# Altium project TIDA-010056.PrjPcb
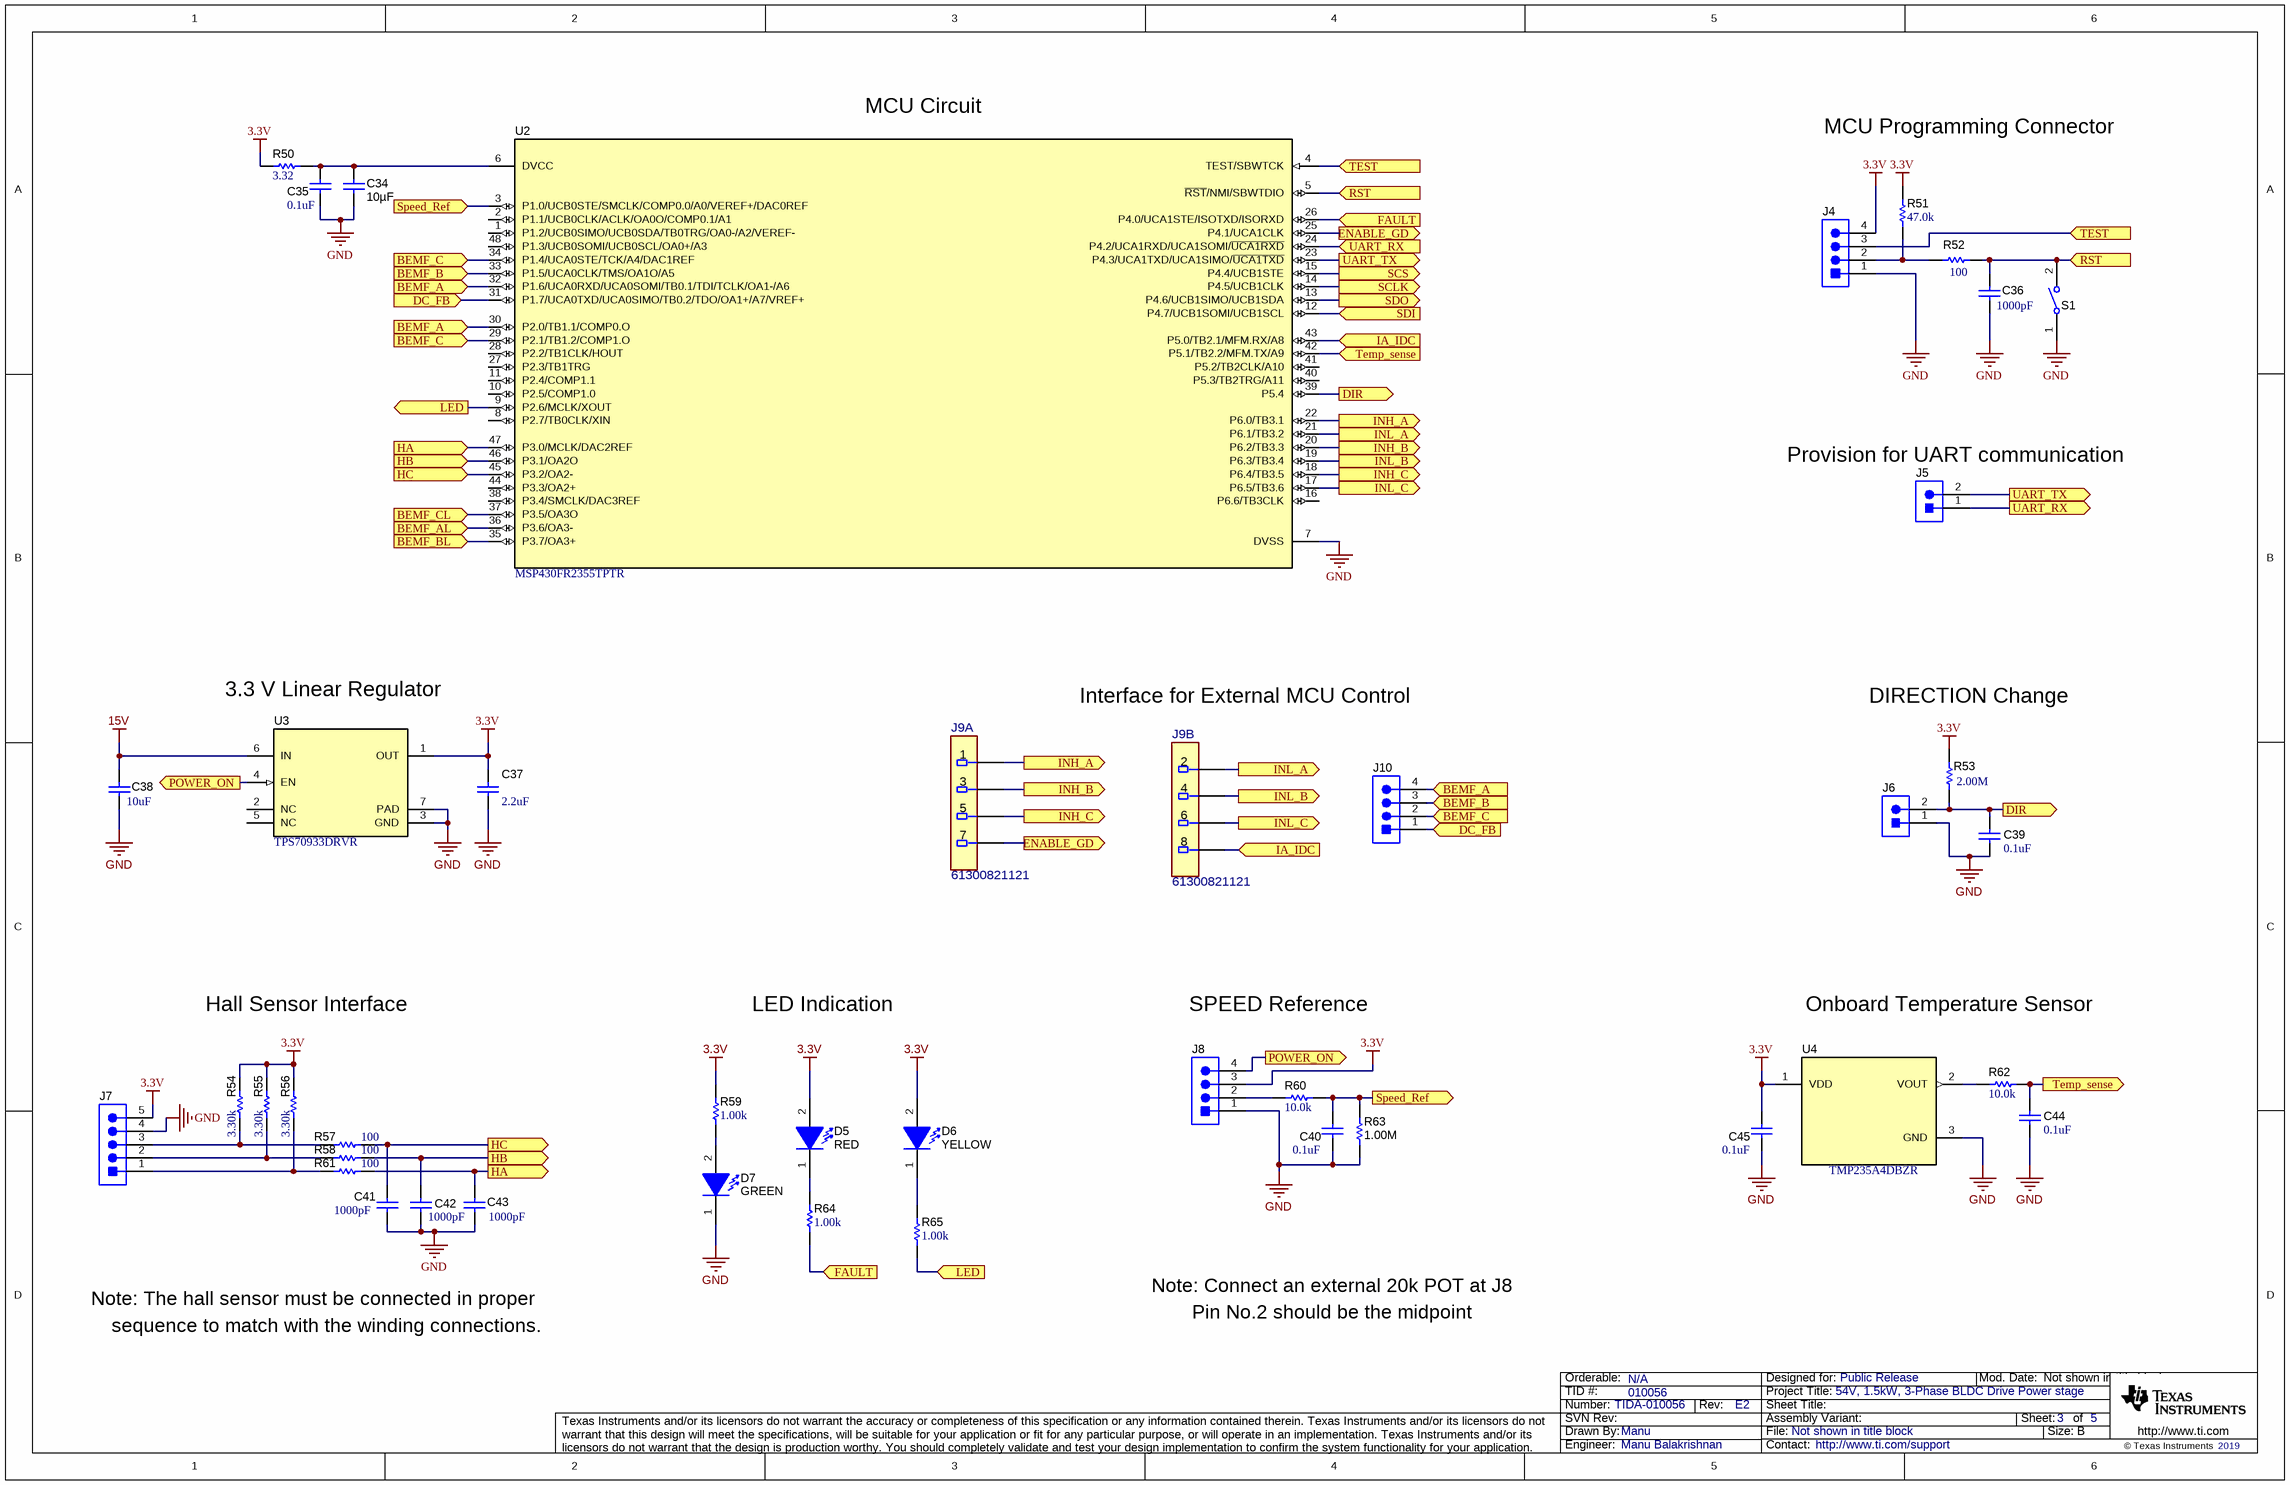
[diagram p0: TIDA-010056_Page2.SchDoc]
CopyrightYear: 2019; EVM_orderable: N/A; PCB_Layout: Manu Balakrishnan; PCB_Rev: E2; PRJ_Customer: Public Release; PRJ_Engineer: Manu Balakrishnan; PRJ_Number: TIDA-010056; PRJ_Title: 54V, 1.5kW, 3-Phase BLDC Drive Power stage; SCH_Rev: E2; TechSupport: http://www.ti.com/support; TID: 010056
3 sheets, 54 parts. Net scope: flat (ports and power ports of the same name join across sheets).
Board file: TIDA-010056.PcbDoc
Sheets:
  TIDA-010056_coversheet.SchDoc
  TIDA-010056_Page2.SchDoc
  TIDA-010056_Hardware.SchDoc

## Sheet TIDA-010056_coversheet.SchDoc
size 431 x 279 mm; Date: Not shown in title block; ApprovedBy: Not shown in title block; CheckedBy: Not shown in title block; Author: Not shown in title block; CompanyName: Not shown in title block; DrawnBy: Manu; Engineer: Not shown in title block; Organization: Not shown in title block; Address1: Not shown in title block; Address2: Not shown in title block; Address3: Not shown in title block; Address4: Not shown in title block; DocumentNumber: 1; Revision: Use project parameter SCH_Rev; SheetNumber: 1; SheetTotal: 5; PageSetup: Record=PageOptions|CenterHorizontal=True|CenterVertical=True|PrintScale=1.00|XCorrection=1.00|YCorrection=1.00|PrintKind=0|BorderSize=5000000|LeftOffset=0|BottomOffset=0|Orientation=2|PaperLength=1000|PaperWidth=1000|Scale=100|PaperSource=15|PrintQuality=600|MediaType=1|DitherType=10|PaperKind=Letter|PrintScaleMode=1; CurrentTime: Not shown in title block; CurrentDate: Not shown in title block; Time: Not shown in title block; DocumentFullPathAndName: Not shown in title block; DocumentName: Not shown in title block; ModifiedDate: Not shown in title block; ImagePath: Not shown in title block

### Notes on the sheet
- Drawn By:
- SVN Rev:
- Number:
- TID #:
- Orderable:
- Rev:
- Sheet Title:
- File:
- Project Title:
- Designed for:
- Assembly Variant:
- Mod. Date:
- Sheet:
- Size:
- of
- B
- http://www.ti.com
- Texas Instruments and/or its licensors do not warrant the accuracy or completeness of this specification or any information contained therein. Texas Instruments and/or its licensors do not warrant that this design will meet the specifications, will be suitable for your application or fit for any particular purpose, or will operate in an implementation. Texas Instruments and/or its licensors do not warrant that the design is production worthy. You should completely validate and test your design implementation to confirm the system functionality for your application.
- Engineer:
- Contact:
- © Texas Instruments

## Sheet TIDA-010056_Page2.SchDoc
size 431 x 279 mm; Date: Not shown in title block; ApprovedBy: Not shown in title block; CheckedBy: Not shown in title block; Author: Not shown in title block; CompanyName: Not shown in title block; DrawnBy: Manu; Engineer: Not shown in title block; Organization: Not shown in title block; Address1: Not shown in title block; Address2: Not shown in title block; Address3: Not shown in title block; Address4: Not shown in title block; DocumentNumber: 1; Revision: Use project parameter SCH_Rev; SheetNumber: 3; SheetTotal: 5; PageSetup: Record=PageOptions|CenterHorizontal=True|CenterVertical=True|PrintScale=1.00|XCorrection=1.00|YCorrection=1.00|PrintKind=0|BorderSize=5000000|LeftOffset=0|BottomOffset=0|Orientation=2|PaperLength=1000|PaperWidth=1000|Scale=100|PaperSource=15|PrintQuality=600|MediaType=1|DitherType=10|PaperKind=Letter|PrintScaleMode=1; CurrentTime: Not shown in title block; CurrentDate: Not shown in title block; Time: Not shown in title block; DocumentFullPathAndName: Not shown in title block; DocumentName: Not shown in title block; ModifiedDate: Not shown in title block; ImagePath: Not shown in title block

### Parts
C34  ValueDisplayed: 10µF  [0603]  (hidden comment: GRM188R61A106KE69D)
C35  ValueDisplayed: 0.1uF  [0402]  (hidden comment: GCM155R71A104KA55D)
C36  ValueDisplayed: 1000pF  [0402]  (hidden comment: GRM155R71C102KA01D)
C37  ValueDisplayed: 2.2uF  [0402]  (hidden comment: 885012105013)
C38  ValueDisplayed: 10uF  [1206_190]  (hidden comment: C3216X7R1V106M160AC)
C39  ValueDisplayed: 0.1uF  [0402]  (hidden comment: GCM155R71A104KA55D)
C40  ValueDisplayed: 0.1uF  [0402]  (hidden comment: GCM155R71A104KA55D)
C41  ValueDisplayed: 1000pF  [0402]  (hidden comment: GRM155R71C102KA01D)
C42  ValueDisplayed: 1000pF  [0402]  (hidden comment: GRM155R71C102KA01D)
C43  ValueDisplayed: 1000pF  [0402]  (hidden comment: GRM155R71C102KA01D)
C44  ValueDisplayed: 0.1uF  [0402]  (hidden comment: GCM155R71A104KA55D)
C45  ValueDisplayed: 0.1uF  [0402]  (hidden comment: GCM155R71A104KA55D)
D5  value RED  [WL-SMCW_GREEN]  (hidden comment: 150060GS75000)
D6  value YELLOW  [WL-SMCW_GREEN]  (hidden comment: 150060GS75000)
D7  value GREEN  [WL-SMCW_GREEN]  (hidden comment: 150060GS75000)
J4  61300411121  [WURTH_61300411121]  (value not drawn)
J5  61300211121  [WURTH_61300211121]  (value not drawn)
J6  61300211121  [WURTH_61300211121]  (value not drawn)
J7  61300511121  [Wurth_61300511121]  (value not drawn)
J8  61300411121  [WURTH_61300411121]  (value not drawn)
J9  61300821121  [FP-61300821121_HDR8-MFG]  (parts A,B of 2)
J10  61300411121  [WURTH_61300411121]  (value not drawn)
R50  ValueDisplayed: 3.32  [0402]  (hidden comment: CRCW04023R32FKED)
R51  ValueDisplayed: 47.0k  [0402]  (hidden comment: RC0402FR-0747KL)
R52  ValueDisplayed: 100  [0402]  (hidden comment: ERJ-2GEJ101X)
R53  ValueDisplayed: 2.00M  [0402]  (hidden comment: CRCW04022M00FKED)
R54  ValueDisplayed: 3.30k  [0402]  (hidden comment: ERJ-2RKF3301X)
R55  ValueDisplayed: 3.30k  [0402]  (hidden comment: ERJ-2RKF3301X)
R56  ValueDisplayed: 3.30k  [0402]  (hidden comment: ERJ-2RKF3301X)
R57  ValueDisplayed: 100  [0402]  (hidden comment: ERJ-2GEJ101X)
R58  ValueDisplayed: 100  [0402]  (hidden comment: ERJ-2GEJ101X)
R59  ValueDisplayed: 1.00k  [0402]  (hidden comment: ERJ-2RKF1001X)
R60  ValueDisplayed: 10.0k  [0402]  (hidden comment: ERJ-2RKF1002X)
R61  ValueDisplayed: 100  [0402]  (hidden comment: ERJ-2GEJ101X)
R62  ValueDisplayed: 10.0k  [0402]  (hidden comment: ERJ-2RKF1002X)
R63  ValueDisplayed: 1.00M  [0402]  (hidden comment: ERJ-2RKF1004X)
R64  ValueDisplayed: 1.00k  [0402]  (hidden comment: ERJ-2RKF1001X)
R65  ValueDisplayed: 1.00k  [0402]  (hidden comment: ERJ-2RKF1001X)
S1  434121025816  [SW_434121025816]  (value not drawn)
U2  MSP430FR2355TPTR  [PT0048A_N]
U3  TPS70933DRVR  [DRV0006A]
U4  TMP235A4DBZR  [DBZ0003A_N]

### Ports
BEMF_A (in), BEMF_AL (in), BEMF_B (in), BEMF_BL (in), BEMF_C (in), BEMF_CL (in), DC_FB (in), DIR (out), ENABLE_GD (out), FAULT (in), HA (in), HA (out), HB (in), HB (out), HC (in), HC (out), IA_IDC (in), INH_A (out), INH_B (out), INH_C (out), INL_A (out), INL_B (out), INL_C (out), LED (in), LED (out), POWER_ON (out), RST (in), SCLK (out), SCS (out), SDI (in), SDO (out), Speed_Ref (in), Speed_Ref (out), Temp_sense (in), Temp_sense (out), TEST (in), UART_RX (in), UART_RX (out), UART_TX (out)

### Nets
3.3V: C37.1 C45.1 D5.2(A) D6.2(A) J4.4 J7.5 J8.3 R50.1 R51.2 R53.2 R54.2 R55.2 R56.2 R59.2 U3.1(OUT) U4.1(VDD)
15V: C38.1 U3.6(IN)
GND: C34.2 C35.2 C36.2 C37.2 C38.2 C39.2 C40.2 C41.2 C42.2 C43.2 C44.2 C45.2 D7.1(K) J4.1 J6.1 J7.4 J8.1 R63.1 S1.1 U2.7(DVSS) U3.3(GND) U3.7(PAD) U4.3(GND)
BEMF_A: J10.4 U2.30(P2.0/TB1.1/COMP0.O) U2.32(P1.6/UCA0RXD/UCA0SOMI/TB0.1/TDI/TCLK/OA1-/A6) ; port BEMF_A
BEMF_AL: U2.36(P3.6/OA3-) ; port BEMF_AL
BEMF_B: J10.3 U2.33(P1.5/UCA0CLK/TMS/OA1O/A5) ; port BEMF_B
BEMF_BL: U2.35(P3.7/OA3+) ; port BEMF_BL
BEMF_C: J10.2 U2.29(P2.1/TB1.2/COMP1.O) U2.34(P1.4/UCA0STE/TCK/A4/DAC1REF) ; port BEMF_C
BEMF_CL: U2.37(P3.5/OA3O) ; port BEMF_CL
DC_FB: J10.1 U2.31(P1.7/UCA0TXD/UCA0SIMO/TB0.2/TDO/OA1+/A7/VREF+) ; port DC_FB
DIR: C39.1 J6.2 R53.1 U2.39(P5.4) ; port DIR
ENABLE_GD: J9.7 U2.25(P4.1/UCA1CLK) ; port ENABLE_GD
FAULT: R64.1 U2.26(P4.0/UCA1STE/ISOTXD/ISORXD) ; port FAULT
HA: C43.1 R61.2 U2.47(P3.0/MCLK/DAC2REF) ; port HA
HB: C42.1 R58.2 U2.46(P3.1/OA2O) ; port HB
HC: C41.1 R57.2 U2.45(P3.2/OA2-) ; port HC
IA_IDC: J9.8 U2.43(P5.0/TB2.1/MFM.RX/A8) ; port IA_IDC
INH_A: J9.1 U2.22(P6.0/TB3.1) ; port INH_A
INH_B: J9.3 U2.20(P6.2/TB3.3) ; port INH_B
INH_C: J9.5 U2.18(P6.4/TB3.5) ; port INH_C
INL_A: J9.2 U2.21(P6.1/TB3.2) ; port INL_A
INL_B: J9.4 U2.19(P6.3/TB3.4) ; port INL_B
INL_C: J9.6 U2.17(P6.5/TB3.6) ; port INL_C
LED: R65.1 U2.9(P2.6/MCLK/XOUT) ; port LED
POWER_ON: J8.4 U3.4(EN) ; port POWER_ON
RST: C36.1 R52.2 S1.2 U2.5(~{RST}/NMI/SBWTDIO) ; port RST
SCLK: U2.14(P4.5/UCB1CLK) ; port SCLK
SCS: U2.15(P4.4/UCB1STE) ; port SCS
SDI: U2.12(P4.7/UCB1SOMI/UCB1SCL) ; port SDI
SDO: U2.13(P4.6/UCB1SIMO/UCB1SDA) ; port SDO
Speed_Ref: C40.1 R60.1 R63.2 U2.3(P1.0/UCB0STE/SMCLK/COMP0.0/A0/VEREF+/DAC0REF) ; port Speed_Ref
Temp_sense: C44.1 R62.1 U2.42(P5.1/TB2.2/MFM.TX/A9) ; port Temp_sense
TEST: J4.3 U2.4(TEST/SBWTCK) ; port TEST
UART_RX: J5.1 U2.24(P4.2/UCA1RXD/UCA1SOMI/~{UCA1RXD}) ; port UART_RX
UART_TX: J5.2 U2.23(P4.3/UCA1TXD/UCA1SIMO/~{UCA1TXD}) ; port UART_TX
NetC34_1: C34.1 C35.1 R50.2 U2.6(DVCC)
NetD5_1: D5.1(K) R64.2
NetD6_1: D6.1(K) R65.2
NetD7_2: D7.2(A) R59.1
NetJ4_2: J4.2 R51.1 R52.1
NetJ7_1: J7.1 R56.1 R61.1
NetJ7_2: J7.2 R55.1 R58.1
NetJ7_3: J7.3 R54.1 R57.1
NetJ8_2: J8.2 R60.2
NetR62_2: R62.2 U4.2(VOUT)

Not connected (* = marked no-connect by the designer): U2 1(P1.2/UCB0SIMO/UCB0SDA/TB0TRG/OA0-/A2/VEREF-) 2(P1.1/UCB0CLK/ACLK/OA0O/COMP0.1/A1) 8(P2.7/TB0CLK/XIN) 10(P2.5/COMP1.0) 11(P2.4/COMP1.1) 16(P6.6/TB3CLK) 27(P2.3/TB1TRG) 28(P2.2/TB1CLK/HOUT) 38(P3.4/SMCLK/DAC3REF) 40(P5.3/TB2TRG/A11) 41(P5.2/TB2CLK/A10) 44(P3.3/OA2+) 48(P1.3/UCB0SOMI/UCB0SCL/OA0+/A3); U3 2(NC) 5(NC)

### Notes on the sheet
- (near U2) MCU Circuit
- MCU Programming Connector
- (near J5) Provision for UART communication
- 3.3 V Linear Regulator
- Interface for External MCU Control
- DIRECTION Change
- Hall Sensor Interface
- LED Indication
- SPEED Reference
- Onboard Temperature Sensor
- Note: The hall sensor must be connected in proper
- Note: Connect an external 20k POT at J8
- sequence to match with the winding connections.
- Pin No.2 should be the midpoint
- Drawn By:
- SVN Rev:
- Number:
- TID #:
- Orderable:
- Rev:
- Sheet Title:
- File:
- Project Title:
- Designed for:
- Assembly Variant:
- Mod. Date:
- Sheet:
- Size:
- of
- B
- http://www.ti.com
- Texas Instruments and/or its licensors do not warrant the accuracy or completeness of this specification or any information contained therein. Texas Instruments and/or its licensors do not warrant that this design will meet the specifications, will be suitable for your application or fit for any particular purpose, or will operate in an implementation. Texas Instruments and/or its licensors do not warrant that the design is production worthy. You should completely validate and test your design implementation to confirm the system functionality for your application.
- Engineer:
- Contact:
- © Texas Instruments

### Library data of the parts
C34 = CMP-0085855-1: CAP, CERM, 10 µF, 10 V,+/- 10%, X5R, 0603; Manufacturer: MuRata; SizeX_mm: 1.6; Value2: 10V; SizeAreaWB_mm2: 4.68; Green_REACh: Incomplete; AEC Category: Q200; SizeArea_mm2: 1.28; SizeY_mm: 0.8; Green_Lifecycle: Active; TaMax_C: 85°C; Value: 10uF; U/M: EA; Polarized: N; TaMin_C: -55°C; SizeZ_mm: 1; CompType: Capacitor; ComponentLink1URL: https://search.murata.co.jp/Ceramy/image/img/A01X/G101/ENG/GRM188R61A106KE69-01.pdf; RoHS: Y; AEC Grade: N/A; PackageReference: 0603; Cap_F: 10µF; ComponentLink1Description: Datasheet link; PartNumber: GRM188R61A106KE69D; Green_EU RoHS: Passed; Green_EU RoHS-2: Incomplete; Cap_Case: 0603; Tolerance_%: 10%; MountType: SMT; Technology: Ceramic; AEC Qualified: N; TempCo: X5R; VDC_V: 10V
C35 C39 C40 C44 C45 = CMP-0006350-2: CAP, CERM, 0.1 uF, 10 V, +/- 10%, X7R, AEC-Q200 Grade 1, 0402; Manufacturer: MuRata; TaMin_C: -55°C; Polarized: N; SizeAreaWB_mm2: 3; Value1: Unknown; U/M: EA; Value: 0.1uF; TaMax_C: 125°C; SizeZ_mm: 0.6; SizeX_mm: 1; SizeY_mm: 0.5; Value2: 10V; AEC Qualified: Y; Cap_F: 100nF; AEC Category: Q200; Publisher: Texas Instruments; TempCo: X7R; Published: 2008-06-19; RoHS: Y; MountType: SMT; Supplier 1: Mouser; PackageReference: 0402; Tolerance_%: 10%; Cap_Case: 0402; SizeArea_mm2: 0.5; CompType: Capacitor; LatestRevisionDate: 2017-03-09; PartNumber: GCM155R71A104KA55D; VDC_V: 10V; ComponentLink1Description: Datasheet link; AEC Grade: 1; Supplier Part Number 1: 81-GCM155R71A104K5D; Technology: Ceramic; ComponentLink1URL: http://search.murata.co.jp/Ceramy/image/img/A01X/G101/ENG/GCM155R71A104KA55-01.pdf
C36 C41-C43 = CMP-0006638-2: CAP, CERM, 1000 pF, 16 V, +/- 10%, X7R, 0402; Manufacturer: MuRata; TaMin_C: -55°C; Polarized: N; SizeAreaWB_mm2: 3; Value1: Unknown; U/M: EA; Value: 1000pF; TaMax_C: 125°C; SizeZ_mm: 0.6; SizeX_mm: 1; SizeY_mm: 0.5; Value2: 16V; Cap_F: 1nF; AEC Category: Q200; Supplier Part Number 2: 81-GRM155R71C102KA1D; Publisher: Texas Instruments; Supplier 2: Mouser; TempCo: X7R; Published: 2008-06-19; RoHS: Y; MountType: SMT; Supplier 1: Digi-Key; PackageReference: 0402; Tolerance_%: 10%; Cap_Case: 0402; SizeArea_mm2: 0.5; CompType: Capacitor; LatestRevisionDate: 2017-03-09; PartNumber: GRM155R71C102KA01D; AEC Qualified: ?; VDC_V: 16V; ComponentLink1Description: Datasheet link; Supplier Part Number 1: GRM155R71C102KA01D-ND; Technology: Ceramic; ComponentLink1URL: http://search.murata.co.jp/Ceramy/PnsearchViewAction.do?HnOFG=ON&HnNFG=ON&SEL_CNT=50&sLang=en&sKey=GRM155R71C102KA01D&x=9&y=9&search=startwith
C37 = CMP-0006222-2: CAP, CERM, 2.2 uF, 10 V, +/- 20%, X5R, 0402; Manufacturer: Wurth Elektronik; TaMin_C: -55°C; Polarized: N; SizeAreaWB_mm2: 3; Value1: Unknown; U/M: EA; Value: 2.2uF; TaMax_C: 85°C; SizeZ_mm: 0.6; SizeX_mm: 1; SizeY_mm: 0.5; Value2: 10V; Cap_F: 2.2µF; AEC Category: Q200; Publisher: Texas Instruments; TempCo: X5R; Published: 2008-06-19; RoHS: Y; MountType: SMT; Supplier 1: Mouser; PackageReference: 0402; Tolerance_%: 20%; Cap_Case: 0402; SizeArea_mm2: 0.5; CompType: Capacitor; LatestRevisionDate: 2017-03-09; PartNumber: 885012105013; AEC Qualified: N; VDC_V: 10V; ComponentLink1Description: Datasheet link; AEC Grade: N/A; Supplier Part Number 1: 710-885012105013; Technology: Ceramic; ComponentLink1URL: http://katalog.we-online.de/pbs/datasheet/885012105013.pdf
C38 = CMP-0008706-2: CAP, CERM, 10 uF, 35 V, +/- 20%, X7R, 1206_190; Manufacturer: TDK; TaMin_C: -55°C; Polarized: N; SizeAreaWB_mm2: 10.92; Value1: Unknown; U/M: EA; Value: 10uF; TaMax_C: 125°C; SizeZ_mm: 1.9; SizeX_mm: 3.2; SizeY_mm: 1.6; Cap_Case: 1206; Value2: 35V; SizeArea_mm2: 5.12; Cap_F: 10µF; AEC Category: Q200; Supplier Part Number 2: 04X3300; Publisher: Texas Instruments; Supplier 2: Newark; Supplier Part Number 3: 810-C3216X7R1V106M; TempCo: X7R; Supplier 3: Mouser; Published: 2008-06-19; RoHS: Y; MountType: SMT; Supplier 1: Digi-Key; PackageReference: 1206_190; Tolerance_%: 20%; CompType: Capacitor; LatestRevisionDate: 2017-03-09; PartNumber: C3216X7R1V106M160AC; AEC Qualified: ?; VDC_V: 35V; ComponentLink1Description: Datasheet link; Supplier Part Number 1: 445-8034-1-ND; Technology: Ceramic; ComponentLink1URL: http://product.tdk.com/en/catalog/datasheets/mlcc_commercial_general_en.pdf
D5 = 150060GS75000: LED RED CLEAR 0603 SMD; Manufacturer: Wurth Elektronics Inc; PartNumber: 150060RS75000; Type: InGaN; Vf_V: 3.2; Value2: 2V; Io_A: 0.02; Tjmax_C: 85; Value1: W; Angle: 140; U/M: EA; CompType: LED; SymbolVersion: 2008-11-06; MountType: SMT; RoHS: Y; PackageReference: LED_0603; Color: Red; Published: 2008-07-11; Publisher: Texas Instruments; ComponentLink1URL: Visible Name Value Type    False ComponentLink1URL http://katalog.we-online.de/led/datasheet/150060GS75000.pdf STRING; ComponentLink1Description: Datasheet link; LatestRevisionDate: 2016-01-08; Supplier 1: Digi-Key; Supplier Part Number 1: 732-4978-1-ND; Supplier 2: Mouser; Supplier Part Number 2: 710-150060GS75000; Supplier 3: Farnell; Supplier Part Number 3: 2322070
D6 = 150060GS75000: LED YELLOW CLEAR 0603 SMD; Manufacturer: Wurth Elektronics Inc; PartNumber: 150060YS75000; Type: InGaN; Vf_V: 2V; Io_A: 0.02; Tjmax_C: 85; Value1: W; Angle: 140; U/M: EA; CompType: LED; SymbolVersion: 2008-11-06; MountType: SMT; RoHS: Y; PackageReference: LED_0603; Value2: 2V; Color: Yellow; Published: 2008-07-11; Publisher: Texas Instruments; ComponentLink1URL: http://katalog.we-online.de/led/datasheet/150060YS75000.pdf; ComponentLink1Description: Datasheet link; LatestRevisionDate: 2016-01-08; Supplier 1: Digi-Key; Supplier Part Number 1: 732-4981-1-ND; Supplier 2: Mouser; Supplier Part Number 2: 710-150060GS75000; Supplier 3: Farnell; Supplier Part Number 3: 2322070
D7 = 150060GS75000: LED, Green, SMD; Manufacturer: Wurth Elektronics Inc; Type: InGaN; Vf_V: 3.2; Value2: 3.2V; Io_A: 0.02; Tjmax_C: 85; Value1: W; Angle: 140; U/M: EA; CompType: LED; PartNumber: 150060GS75000; SymbolVersion: 2008-11-06; MountType: SMT; RoHS: Y; PackageReference: LED_0603; Color: Green; Published: 2008-07-11; Publisher: Texas Instruments; ComponentLink1URL: http://katalog.we-online.de/led/datasheet/150060GS75000.pdf; ComponentLink1Description: Datasheet link; LatestRevisionDate: 2016-01-08; Supplier 1: Digi-Key; Supplier Part Number 1: 732-4971-1-ND; Supplier 2: Mouser; Supplier Part Number 2: 710-150060GS75000; Supplier 3: Farnell; Supplier Part Number 3: 2322070
J4 J8 J10 = CMP-0054798-2: Header, 2.54 mm, 4x1, Gold, TH; Manufacturer: Wurth Elektronik; Pitch_mm: 2.54; Gender: Male; Row_Count: 1; Cert_UL: Y; Shrouded: N; Supplier Part Number 3: 2356155; ClassName: Header; MountType: TH; ComponentLink1Description: Datasheet URL; PartNumber: 61300411121; PackageReference: Header, 2.54mm, 4x1, TH; Color: Black; Supplier 3: Farnell; Supplier Part Number 1: 732-5317-ND; Supplier 2: Newark; ComponentLink1URL: http://katalog.we-online.de/em/datasheet/6130xx11121.pdf; CompType: Header; PinCount: 4; Supplier 1: Digi-Key; RoHS: Y; ContactFinish: Gold; Supplier Part Number 2: 20X0951; Orientation: Vertical
J5 J6 = CMP-0054794-2: Header, 2.54 mm, 2x1, Gold, TH; Manufacturer: Wurth Elektronik; Shrouded: N; Gender: Male; Green_REACh: Passed; Pitch_mm: 2.54; Green_Lifecycle: Active; Row_Count: 1; Cert_UL: Y; Supplier Part Number 2: 20X0948; Orientation: Vertical; PinCount: 2; ClassName: Header; Supplier 2: Newark; PackageReference: Header, 2.54mm, 2x1, TH; CompType: Header; ComponentLink1Description: Datasheet URL; Supplier 1: Digi-Key; Green_EU RoHS-2: Incomplete; ComponentLink1URL: http://katalog.we-online.de/em/datasheet/6130xx11121.pdf; Green_EU RoHS: Passed; MountType: TH; Supplier Part Number 3: 710-61300211121; RoHS: Y; Supplier Part Number 1: 732-5315-ND; ContactFinish: Gold; Supplier 3: Mouser; PartNumber: 61300211121; Color: Black
J7 = CMP-0084909-1: Header, 2.54mm, 5x1, Gold, TH; Manufacturer: Wurth Elektronik; Pitch_mm: 2.54; Gender: Male; Row_Count: 1; Shrouded: N; Current_A: 3A; Voltage_V: 250V; Color: Black; PinCount: 5; ContactFinish: Gold; ComponentLink1URL: https://katalog.we-online.de/em/datasheet/6130xx11121.pdf; ComponentLink1Description: Datasheet URL; CompType: Header; MountType: TH; PartNumber: 61300511121; RoHS: Y; PackageReference: Header, 2.54mm, 5x1, TH; ClassName: Header; Orientation: Vertical
J9 = CMP-0087153-1: CONN HEADER VERT 8POS 2.54MM; Manufacturer: Wurth Electronics; Voltage_V: 250V; Row_Count: 2; Current_A: 3A; ContactFinish: Gold; ComponentLink1URL: https://katalog.we-online.com/em/datasheet/6130xx21121.pdf; PinCount: 8; ComponentLink1Description: Datasheet; Symbol Name: SYM-61300821121; RoHS: TRUE; PartNumber: 61300821121; PackageReference: HDR8; PartId: 1
R50 = CMP-0026357-2: RES, 3.32, 1%, 0.063 W, AEC-Q200 Grade 0, 0402; Manufacturer: Vishay-Dale; Power_W: 63mW; TempCo: 100 ppm/C; Value_Code: 3R32; Value: 3.32; SizeX_mm: 1; SizeY_mm: 0.5; SizeZ_mm: 0.6; Value2: 0.063W; AEC Qualified: Y; EIA_Code: E96; VDC_V: 50V; AEC Category: Q200; AEC Grade: 0; ComponentLink1URL: http://www.vishay.com/docs/20035/dcrcwe3.pdf; Supplier Part Number 2: 71-CRCW0402-3.32-E3; Supplier 2: Mouser; Supplier Part Number 3: 1878586; Supplier 3: Farnell; RoHS: E; Value1: 1%; MountType: SMT; Supplier 1: Digi-Key; PackageReference: 0402; Tolerance_%: 1%; Res_ohm: 3.32; SizeArea_mm2: 0.5; CompType: Resistor; PartNumber: CRCW04023R32FKED; ComponentLink1Description: Datasheet link; Supplier Part Number 1: 541-3.32LLCT-ND; Technology: Thick Film
R51 = CMP-0026737-1: RES, 47.0 k, 1%, 0.0625 W, 0402; Manufacturer: Yageo America; Power_W: 62.5mW; TempCo: 100 ppm/C; Value_Code: 47k0; U/M: EA; Value: 47.0k; Res_ohm: 47k; SizeX_mm: 1; SizeY_mm: 0.5; SizeZ_mm: 0.6; AEC Qualified: N; VDC_V: 50V; AEC Category: Q200; ComponentLink1URL: http://www.yageo.com/documents/recent/PYu-RC0402_51_RoHS_L_6_r.pdf; Supplier Part Number 2: 67R9937; Publisher: Texas Instruments; Supplier 2: Newark; Supplier Part Number 3: 603-RC0402FR-0747KL; Supplier 3: Mouser; Published: 2008-06-26; RoHS: Y; Value1: 1%; MountType: SMT; Supplier 1: Digi-Key; PackageReference: 0402; Tolerance_%: 1%; Value2: 0.0625W; SizeArea_mm2: 0.5; CompType: Resistor; LatestRevisionDate: 2017-03-09; PartNumber: RC0402FR-0747KL; ComponentLink1Description: Datasheet link; AEC Grade: N/A; Supplier Part Number 1: 311-47.0KLRCT-ND; Technology: Thick Film
R52 R57 R58 R61 = CMP-0026993-2: RES, 100, 5%, 0.1 W, AEC-Q200 Grade 0, 0402; Manufacturer: Panasonic; Power_W: 100mW; TempCo: 200 ppm/C; Value_Code: 100R; U/M: EA; Value: 100; EIA_Code: E24; SizeX_mm: 1; SizeY_mm: 0.5; SizeZ_mm: 0.6; Value2: 0.1W; AEC Qualified: Y; AEC Grade: 0; AEC Category: Q200; Supplier Part Number 2: 65T8246; Publisher: Texas Instruments; Supplier 2: Newark; Supplier Part Number 3: 2059210; Supplier 3: Farnell; Published: 2008-06-26; RoHS: Y; Value1: 5%; MountType: SMT; Supplier 1: Digi-Key; PackageReference: 0402; Tolerance_%: 5%; Res_ohm: 100; SizeArea_mm2: 0.5; CompType: Resistor; LatestRevisionDate: 2017-03-09; PartNumber: ERJ-2GEJ101X; ComponentLink1Description: Datasheet link; Supplier Part Number 1: P100JCT-ND; Technology: Thick Film; ComponentLink1URL: https://industrial.panasonic.com/cdbs/www-data/pdf/RDA0000/AOA0000C84.pdf
R53 = CMP-0026245-2: RES, 2.00 M, 1%, 0.063 W, AEC-Q200 Grade 0, 0402; Manufacturer: Vishay-Dale; Power_W: 63mW; TempCo: 100 ppm/C; Value_Code: 2M00; Value: 2.00Meg; EIA_Code: E96; Res_ohm: 2M; SizeX_mm: 1; SizeY_mm: 0.5; SizeZ_mm: 0.6; Value2: 0.063W; AEC Qualified: Y; VDC_V: 50V; AEC Category: Q200; AEC Grade: 0; ComponentLink1URL: http://www.vishay.com/docs/20035/dcrcwe3.pdf; Supplier Part Number 2: 52K6816; Supplier 2: Newark; Supplier Part Number 3: 71-CRCW0402-2M-E3; Supplier 3: Mouser; RoHS: E; Value1: 1%; MountType: SMT; Supplier 1: Digi-Key; PackageReference: 0402; Tolerance_%: 1%; SizeArea_mm2: 0.5; CompType: Resistor; PartNumber: CRCW04022M00FKED; ComponentLink1Description: Datasheet link; Supplier Part Number 1: 541-2.00MLCT-ND; Technology: Thick Film
R54-R56 = CMP-0026695-1: RES, 3.30 k, 1%, 0.1 W, AEC-Q200 Grade 0, 0402; Manufacturer: Panasonic; Power_W: 100mW; TempCo: 100 ppm/C; Value_Code: 3k30; U/M: EA; Value: 3.30k; Res_ohm: 3.3k; SizeX_mm: 1; SizeY_mm: 0.5; SizeZ_mm: 0.6; Value2: 0.1W; AEC Qualified: Y; VDC_V: 50V; AEC Grade: 0; AEC Category: Q200; ComponentLink1URL: http://industrial.panasonic.com/cdbs/www-data/pdf/RDA0000/AOA0000C86.pdf; Supplier Part Number 2: 64R5278; Publisher: Texas Instruments; Supplier 2: Newark; Supplier Part Number 3: 667-ERJ-2RKF3301X; Supplier 3: Mouser; Published: 2008-06-26; RoHS: Y; Value1: 1%; MountType: SMT; Supplier 1: Digi-Key; PackageReference: 0402; Tolerance_%: 1%; SizeArea_mm2: 0.5; CompType: Resistor; LatestRevisionDate: 2017-03-09; PartNumber: ERJ-2RKF3301X; ComponentLink1Description: Datasheet link; Supplier Part Number 1: P3.30KLCT-ND; Technology: Thick Film
R59 R64 R65 = CMP-0026657-1: RES, 1.00 k, 1%, 0.1 W, 0402; Manufacturer: Panasonic; Power_W: 100mW; TempCo: 100 ppm/C; Value_Code: 1k00; U/M: EA; Value: 1.00k; EIA_Code: E96; Res_ohm: 1k; SizeX_mm: 1; SizeY_mm: 0.5; SizeZ_mm: 0.6; Value2: 0.1W; VDC_V: 50V; AEC Category: Q200; ComponentLink1URL: http://industrial.panasonic.com/www-data/pdf/AOA0000/AOA0000CE2.pdf; Supplier Part Number 2: 64R5247; Publisher: Texas Instruments; Supplier 2: Newark; Supplier Part Number 3: 667-ERJ-2RKF1001X; Supplier 3: Mouser; Published: 2008-06-26; RoHS: Y; Value1: 1%; MountType: SMT; Supplier 1: Digi-Key; PackageReference: 0402; Tolerance_%: 1%; SizeArea_mm2: 0.5; CompType: Resistor; LatestRevisionDate: 2017-03-09; PartNumber: ERJ-2RKF1001X; AEC Qualified: ?; ComponentLink1Description: Datasheet link; Supplier Part Number 1: P1.00KLCT-ND; Technology: Thick Film
R60 R62 = CMP-0026658-1: RES, 10.0 k, 1%, 0.1 W, 0402; Manufacturer: Panasonic; Power_W: 100mW; TempCo: 100 ppm/C; Value_Code: 10k0; U/M: EA; Value: 10.0k; EIA_Code: E96; Res_ohm: 10k; SizeX_mm: 1; SizeY_mm: 0.5; SizeZ_mm: 0.6; Value2: 0.1W; VDC_V: 50V; AEC Category: Q200; ComponentLink1URL: http://industrial.panasonic.com/www-data/pdf/AOA0000/AOA0000CE2.pdf; Supplier Part Number 2: 90W2949; Publisher: Texas Instruments; Supplier 2: Newark; Supplier Part Number 3: 667-ERJ-2RKF1002X; Supplier 3: Mouser; Published: 2008-06-26; RoHS: Y; Value1: 1%; MountType: SMT; Supplier 1: Digi-Key; PackageReference: 0402; Tolerance_%: 1%; SizeArea_mm2: 0.5; CompType: Resistor; LatestRevisionDate: 2017-03-09; PartNumber: ERJ-2RKF1002X; AEC Qualified: ?; ComponentLink1Description: Datasheet link; Supplier Part Number 1: P10.0KLCT-ND; Technology: Thick Film
R63 = CMP-0026660-1: RES, 1.00 M, 1%, 0.1 W, 0402; Manufacturer: Panasonic; Power_W: 100mW; TempCo: 100 ppm/C; Value_Code: 1M00; U/M: EA; Value: 1.00Meg; EIA_Code: E96; Res_ohm: 1M; SizeX_mm: 1; SizeY_mm: 0.5; SizeZ_mm: 0.6; Value2: 0.1W; VDC_V: 50V; AEC Category: Q200; ComponentLink1URL: http://industrial.panasonic.com/www-data/pdf/AOA0000/AOA0000CE2.pdf; Supplier Part Number 2: 64R5250; Publisher: Texas Instruments; Supplier 2: Newark; Supplier Part Number 3: 667-ERJ-2RKF1004X; Supplier 3: Mouser; Published: 2008-06-26; RoHS: Y; Value1: 1%; MountType: SMT; Supplier 1: Digi-Key; PackageReference: 0402; Tolerance_%: 1%; SizeArea_mm2: 0.5; CompType: Resistor; LatestRevisionDate: 2017-03-09; PartNumber: ERJ-2RKF1004X; AEC Qualified: ?; ComponentLink1Description: Datasheet link; Supplier Part Number 1: P1.00MLCT-ND; Technology: Thick Film
S1 = CMP-0002196-1: Switch, Tactile, SPST, 12 V, SMD; Manufacturer: Wurth Elektronik; CurrentRating_mA: 50A; PositionCount: 1; VDC_V: 12V; SwitchFunction: Off-On; Supplier 2: Farnell; Supplier 1: Newark; Supplier Part Number 1: 31T8978; Supplier Part Number 2: 1867991; PartNumber: 434121025816; ComponentLink1Description: Datasheet URL; LatestRevisionDate: 2017-03-09; ComponentLink1URL: http://katalog.we-online.de/em/datasheet/434121025816.pdf; CompType: Switch; PackageReference: SMD, 6x3.9mm; Publisher: Texas Instruments; Circuit: SPST; RoHS: Y; Orientation: Top Actuated; MountType: SMT
U2 = CMP-0013603-2: Mixed-Signal Microcontroller, PT0048A (LQFP-48); Manufacturer: Texas Instruments; SizeX_mm: 9; CompType: IC; SizeZ_mm: 1.6; SizeArea_mm2: 81; SizeAreaWB_mm2: 121; U/M: EA; PackageDescription: LQFP-48; PartNumber: MSP430FR2355TPTR; ComponentLink1URL: https://sps06.itg.ti.com/sites/KMS/crossdivteams/altium/docs/ComponentDatasheets/SLASEC4_MSP430FR2355.int.1.0.pdf; ComponentLink1Description: Datasheet Link; LatestRevisionDate: 2017-03-09; SizeY_mm: 9; Publisher: Texas Instruments; PackageReference: PT0048A; MountType: SMT; Alternate Manufacturer: Texas Instruments
U3 = CMP-0066782-1: 150-mA, 30-V, Ultra-Low IQ, Wide Input Low-Dropout Regulator with Reverse Current Protection, DRV0006A (WSON-6); Alternate PartNumber: TPS70933DRVT; Alternate Manufacturer: Texas Instruments; Green_Lifecycle: Active; SizeAreaWB_mm2: 9.0; Green_REACh: Passed; U/M: EA; SizeZ_mm: 0.8; SizeX_mm: 2.0; SizeArea_mm2: 4.0; CompType: IC; ComponentLink1URL: http://www.ti.com/lit/ds/symlink/tps709.pdf; Publisher: Texas Instruments; PackageDescription: WSON-6; RoHS: Y; Footprint Path 6: C:\AltiumLibraries\Footprints\TI\.PcbLib; MountType: SMT; Green_EU RoHS-2: Passed; Manufacturer: Texas Instruments; Green_EU RoHS: Passed; PackageReference: DRV0006A; SizeY_mm: 2.0; LatestRevisionDate: 2017-06-09; PartNumber: TPS70933DRVR; ComponentLink1Description: Datasheet Link
U4 = CMP-0013240-1: TMP235A4DBZR, DBZ0003A (SOP-3); Manufacturer: Texas Instruments; SizeZ_mm: 1.12; SizeX_mm: 2.5; SizeY_mm: 3; SizeArea_mm2: 7.5; CompType: IC; U/M: EA; SizeAreaWB_mm2: 14; ComponentLink1URL: https://sps06.itg.ti.com/sites/KMS/crossdivteams/altium/docs/ComponentDatasheets/TMP235DBZ MECH DRAWING.docx; Publisher: Texas Instruments; PackageDescription: SOP-3; PackageReference: DBZ0003A; LatestRevisionDate: 2017-03-09; Footprint Path 6: C:\AltiumLibraries\Footprints\TI\.PcbLib; MountType: SMT; PartNumber: TMP235A4DBZR; ComponentLink1Description: Datasheet Link; Alternate Manufacturer: Texas Instruments

## Sheet TIDA-010056_Hardware.SchDoc
size 431 x 279 mm; Date: Not shown in title block; ApprovedBy: Not shown in title block; CheckedBy: Not shown in title block; Author: Not shown in title block; CompanyName: Not shown in title block; DrawnBy: Manu; Engineer: Not shown in title block; Organization: Not shown in title block; Address1: Not shown in title block; Address2: Not shown in title block; Address3: Not shown in title block; Address4: Not shown in title block; DocumentNumber: 1; Revision: Use project parameter SCH_Rev; SheetNumber: 5; SheetTotal: 5; PageSetup: Record=PageOptions|CenterHorizontal=True|CenterVertical=True|PrintScale=1.00|XCorrection=1.00|YCorrection=1.00|PrintKind=0|BorderSize=5000000|LeftOffset=0|BottomOffset=0|Orientation=2|PaperLength=1000|PaperWidth=1000|Scale=100|PaperSource=15|PrintQuality=600|MediaType=1|DitherType=10|PaperKind=Letter|PrintScaleMode=1; CurrentTime: Not shown in title block; CurrentDate: Not shown in title block; Time: Not shown in title block; DocumentFullPathAndName: Not shown in title block; DocumentName: Not shown in title block; ModifiedDate: Not shown in title block; ImagePath: Not shown in title block
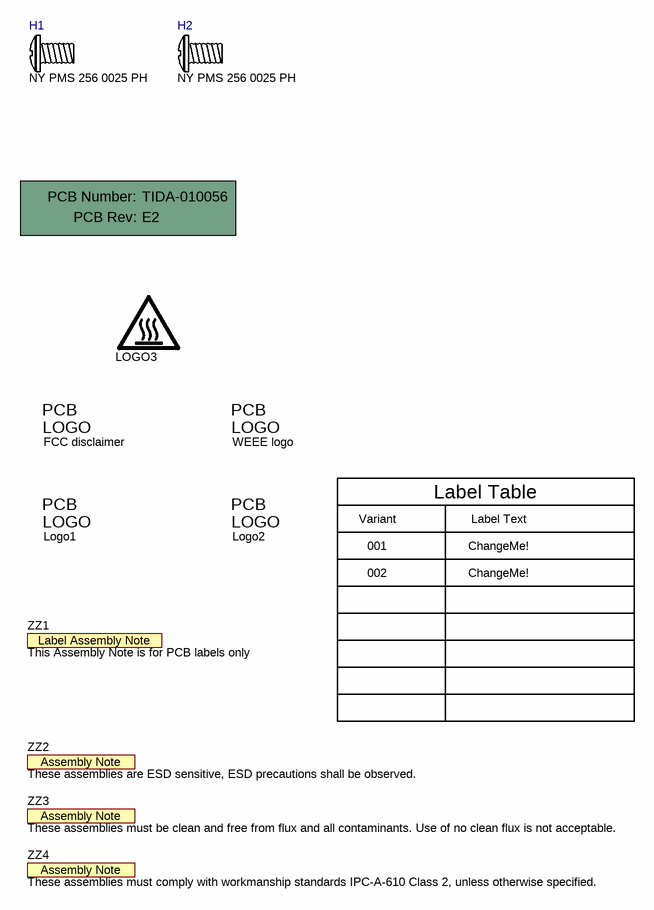
[diagram p1: TIDA-010056_Hardware.SchDoc]

### Parts
!PCB1  Printed Circuit Board  (value not drawn)  (mechanical)
H1  NY PMS 256 0025 PH  [NY PMS 256 0025 PH]
H2  NY PMS 256 0025 PH  [NY PMS 256 0025 PH]
Logo1  ESD Susceptible  [ESD_Overlay_small]  (value not drawn)  (no BOM)
Logo2  Pb-Free Symbol  [Pb-Free_Overlay_small]  (value not drawn)  (no BOM)
LOGO3  CAUTION HOT SURFACE  [IEC_HotSurface_small]  (value not drawn)  (no BOM)
Logo4  FCC disclaimer  [FCC_disclaimer]  (no BOM)
Logo5  WEEE logo  [WEEE_Minimum]  (no BOM)
ZZ1  This Assembly Note is for PCB labels only  [AssemblyNoteLabel]  (no BOM)
ZZ2  These assemblies are ESD sensitive, ESD precautions shall be observed.  [AssemblyNote]  (no BOM)
ZZ3  These assemblies must be clean and free from flux and all contaminants. Use of no clean flux is not acceptable.  [AssemblyNote]  (no BOM)
ZZ4  These assemblies must comply with workmanship standards IPC-A-610 Class 2, unless otherwise specified.  [AssemblyNote]  (no BOM)

### Notes on the sheet
- Variant
- 001
- Label Table
- Label Text
- ChangeMe!
- 002
- Drawn By:
- SVN Rev:
- Number:
- TID #:
- Orderable:
- Rev:
- Sheet Title:
- File:
- Project Title:
- Designed for:
- Assembly Variant:
- Mod. Date:
- Sheet:
- Size:
- of
- B
- http://www.ti.com
- Texas Instruments and/or its licensors do not warrant the accuracy or completeness of this specification or any information contained therein. Texas Instruments and/or its licensors do not warrant that this design will meet the specifications, will be suitable for your application or fit for any particular purpose, or will operate in an implementation. Texas Instruments and/or its licensors do not warrant that the design is production worthy. You should completely validate and test your design implementation to confirm the system functionality for your application.
- Engineer:
- Contact:
- © Texas Instruments
- (in symbol AssemblyNote) Assembly Note
- (in symbol AssemblyNoteLabel) Label Assembly Note
- (in symbol CMP-0074769-1) PCB; LOGO
- (in symbol ESD_Susceptible) PCB; LOGO
- (in symbol FCC_disclaimer) PCB; LOGO
- (in symbol Pb-Free) PCB; LOGO
- (in symbol PCB) PCB Number:; PCB Rev:

### Library data of the parts
!PCB1 = PCB: Manufacturer: Any; PartNumber: TIDA-010056; SymbolCreator: a0412235; SymbolVersion: 2012-05-30; CompType: PCB; RoHS: O; MountType: N/A; Publisher: Texas Instruments; LatestRevisionDate: 2015-02-25
H1 H2 = NY PMS 256 0025 PH: MACHINE SCREW PAN PHILLIPS 2-56; Manufacturer: B&F Fastener Supply; SymbolCreator: a0412235; SymbolVersion: 2013-06-24; CompType: Screw; PartNumber: NY PMS 256 0025 PH; RoHS: Y; PackageReference: Machine Screw Pan Phillips 2-56; MountType: N/A; ComponentLink1Description: Datasheet Link; ComponentLink1URL: http://www.fasnetdirect.com/refguide/Nylpanms.pdf; Publisher: Texas Instruments; LatestRevisionDate: 2017-05-31; Supplier 1: Digi-Key; Supplier Part Number 1: H530-ND
Logo1 = ESD_Susceptible: ESD Susceptible Symbol; SymbolCreator: a0412235; SymbolVersion: 2011-08-22; Published: 2009-03-03; Publisher: Texas Instruments; LatestRevisionDate: 2016-03-21
Logo2 = Pb-Free: SymbolCreator: a0412235; SymbolVersion: 2011-08-22; Published: 2009-03-03; Publisher: Texas Instruments; LatestRevisionDate: 2016-03-21
LOGO3 = IEC_HotSurface: IEC 61010-1 Hot Surface Warning; SymbolCreator: a0412235; SymbolVersion: 2011-08-22; Published: 2009-03-03; Publisher: Texas Instruments; LatestRevisionDate: 2016-03-21
Logo4 = FCC_disclaimer: SymbolCreator: codlsc; SymbolVersion: 2011-08-22; Published: 2009-03-03; Publisher: Texas Instruments; LatestRevisionDate: 2014-11-20
Logo5 = CMP-0074769-1: Library Reference: WEEE logo; Lib Reference: WEEE logo; PartNumber: WEEE logo
ZZ1 = AssemblyNoteLabel: SymbolCreator: a0412235; SymbolVersion: 2012-06-14; CompType: AssemblyNote; ClassName: AssemblyNote; Publisher: Texas Instruments; LatestRevisionDate: 2012-07-31; LatestRevisionNote: Initial Version; Alternate Manufacturer: -; Alternate PartNumber: -
ZZ2-ZZ4 = AssemblyNote: SymbolCreator: codlsc; SymbolVersion: 2010-05-18; CompType: AssemblyNote; ClassName: AssemblyNote; Publisher: Texas Instruments; LatestRevisionDate: 2012-06-14; LatestRevisionNote: Initial Version; Alternate Manufacturer: -; Alternate PartNumber: -

## Assembly variants
001: not fitted C13 C14 C15 C20 C22 C46 C47 C48 C49 J1 R1 R2 R3 R5 R7 R8 R9 R13 R17 R36 R37 R38 R40 R41 R42 R44 R45 R46